# Altium schematic sheet HF_LPF.SchDoc: PA HF
size 420 x 297 mm; Date: 19.02.2023; ApprovedBy: UA3REO; CheckedBy: UA3REO; Author: RU4PN; CompanyName: WolfTeam; DrawnBy: UA3REO; Engineer: UA3REO; Address1: 1; Address2: 2; Address3: 3; Address4: 4; DocumentNumber: W2 - HF AMP  - LPF; Revision: 0.1; SheetNumber: 3; SheetTotal: 3
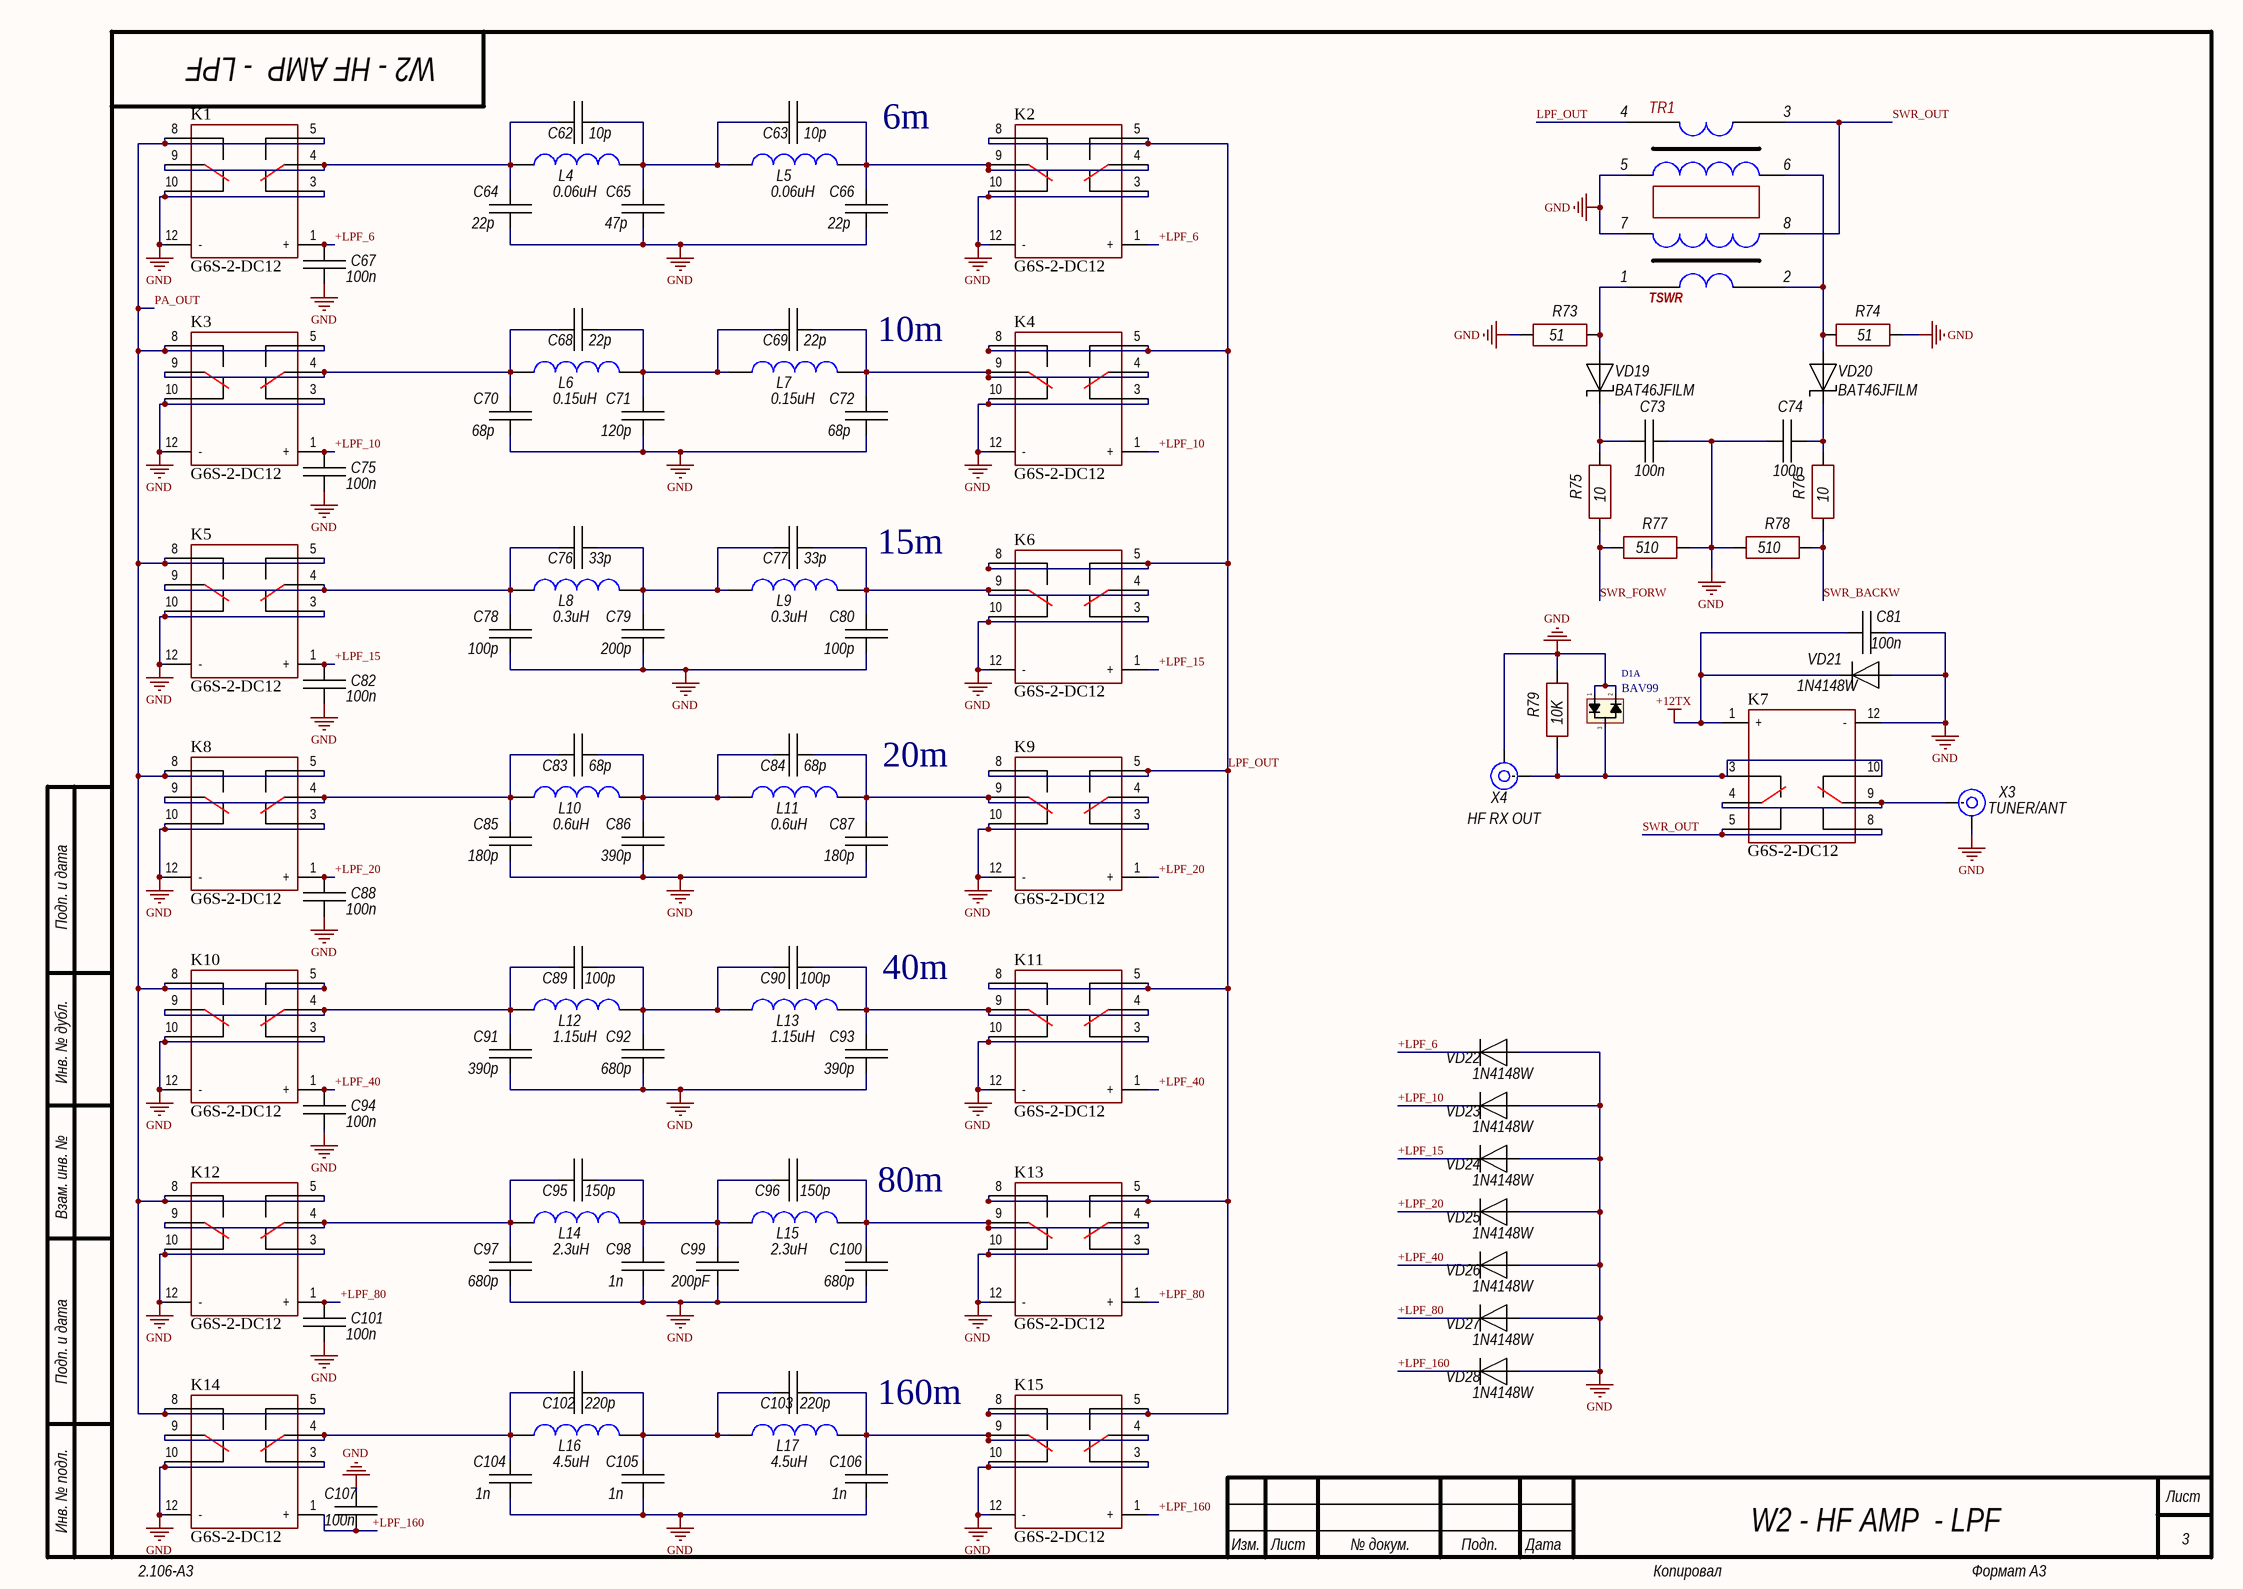
[diagram p0: HF_LPF.SchDoc]

## Parts
C62  10p  [CH1206ATC]
C63  10p  [CH1206ATC]
C64  22p  [CH1206ATC]
C65  47p  [CH1206ATC]
C66  22p  [CH1206ATC]
C67  100n  [CH0805C]
C68  22p  [CH1206ATC]
C69  22p  [CH1206ATC]
C70  68p  [CH1206ATC]
C71  120p  [CH1206ATC]
C72  68p  [CH1206ATC]
C73  100n  [CH1206C]
C74  100n  [CH1206C]
C75  100n  [CH0805C]
C76  33p  [CH1206ATC]
C77  33p  [CH1206ATC]
C78  100p  [CH1206ATC]
C79  200p  [CH1206ATC]
C80  100p  [CH1206ATC]
C81  100n  [CH1206C]
C82  100n  [CH0805C]
C83  68p  [CH1206ATC]
C84  68p  [CH1206ATC]
C85  180p  [CH1206ATC]
C86  390p  [CH1206ATC]
C87  180p  [CH1206ATC]
C88  100n  [CH0805C]
C89  100p  [CH1206ATC]
C90  100p  [CH1206ATC]
C91  390p  [CH1206ATC]
C92  680p  [CH1206ATC]
C93  390p  [CH1206ATC]
C94  100n  [CH0805C]
C95  150p  [CH1206ATC]
C96  150p  [CH1206ATC]
C97  680p  [CH1206ATC]
C98  1n  [CH1206ATC]
C99  200pF  [CH1206ATC]
C100  680p  [CH1206ATC]
C101  100n  [CH0805C]
C102  220p  [CH1206ATC]
C103  220p  [CH1206ATC]
C104  1n  [CH1206ATC]
C105  1n  [CH1206ATC]
C106  1n  [CH1206ATC]
C107  100n  [CH0805C]
D1  BAV99  [SOT23_132]  (part A of 2)
K1  G6S-2-DC12  [G6S-2-DC12]
K2  G6S-2-DC12  [G6S-2-DC12]
K3  G6S-2-DC12  [G6S-2-DC12]
K4  G6S-2-DC12  [G6S-2-DC12]
K5  G6S-2-DC12  [G6S-2-DC12]
K6  G6S-2-DC12  [G6S-2-DC12]
K7  G6S-2-DC12  [G6S-2-DC12]
K8  G6S-2-DC12  [G6S-2-DC12]
K9  G6S-2-DC12  [G6S-2-DC12]
K10  G6S-2-DC12  [G6S-2-DC12]
K11  G6S-2-DC12  [G6S-2-DC12]
K12  G6S-2-DC12  [G6S-2-DC12]
K13  G6S-2-DC12  [G6S-2-DC12]
K14  G6S-2-DC12  [G6S-2-DC12]
K15  G6S-2-DC12  [G6S-2-DC12]
L4  0.06uH  [DR1]
L5  0.06uH  [DR1]
L6  0.15uH  [DR1]
L7  0.15uH  [DR1]
L8  0.3uH  [T68-0]
L9  0.3uH  [T68-0]
L10  0.6uH  [T68-0]
L11  0.6uH  [T68-0]
L12  1.15uH  [T68-0]
L13  1.15uH  [T68-0]
L14  2.3uH  [T68-0]
L15  2.3uH  [T68-0]
L16  4.5uH  [T68-0]
L17  4.5uH  [T68-0]
R73  51  [CH1206R]
R74  51  [CH1206R]
R75  10  [CH0805R]
R76  10  [CH0805R]
R77  510  [CH0805R]
R78  510  [CH0805R]
R79  10K  [CH2512R]
TR1  TSWR  [TANDEM]
VD19  BAT46JFILM  [SOD323]
VD20  BAT46JFILM  [SOD323]
VD21  1N4148W  [SOD123]
VD22  1N4148W  [SOD123]
VD23  1N4148W  [SOD123]
VD24  1N4148W  [SOD123]
VD25  1N4148W  [SOD123]
VD26  1N4148W  [SOD123]
VD27  1N4148W  [SOD123]
VD28  1N4148W  [SOD123]
X3  TUNER/ANT  [CON: SMA]
X4  HF RX OUT  [CON: SMA]

## Nets
+12TX: C81.1 K7.1(+) VD21.2
GND: C64.1 C65.1 C66.1 C67.2 C70.1 C71.1 C72.1 C73.2 C74.1 C75.2 C78.1 C79.1 C80.1 C81.2 C82.2 C85.1 C86.1 C87.1 C88.2 C91.1 C92.1 C93.1 C94.2 C97.1 C98.1 C99.1 C100.1 C101.2 C104.1 C105.1 C106.1 C107.1 D1.1 D1.2 K1.3(NC_1) K1.10(NC_2) K1.12(-) K2.3(NC_1) K2.10(NC_2) K2.12(-) K3.3(NC_1) K3.10(NC_2) K3.12(-) K4.3(NC_1) K4.10(NC_2) K4.12(-) K5.3(NC_1) K5.10(NC_2) K5.12(-) K6.3(NC_1) K6.10(NC_2) K6.12(-) K7.12(-) K8.3(NC_1) K8.10(NC_2) K8.12(-) K9.3(NC_1) K9.10(NC_2) K9.12(-) K10.3(NC_1) K10.10(NC_2) K10.12(-) K11.3(NC_1) K11.10(NC_2) K11.12(-) K12.3(NC_1) K12.10(NC_2) K12.12(-) K13.3(NC_1) K13.10(NC_2) K13.12(-) K14.3(NC_1) K14.10(NC_2) K14.12(-) K15.3(NC_1) K15.10(NC_2) K15.12(-) R73.1 R74.2 R77.2 R78.1 R79.2 TR1.5 TR1.7 VD21.1 VD22.1 VD23.1 VD24.1 VD25.1 VD26.1 VD27.1 VD28.1 X3.2(IN) X4.2(IN)
+LPF_6: C67.1 K1.1(+) K2.1(+) VD22.2
+LPF_10: C75.1 K3.1(+) K4.1(+) VD23.2
+LPF_15: C82.1 K5.1(+) K6.1(+) VD24.2
+LPF_20: C88.1 K8.1(+) K9.1(+) VD25.2
+LPF_40: C94.1 K10.1(+) K11.1(+) VD26.2
+LPF_80: C101.1 K12.1(+) K13.1(+) VD27.2
+LPF_160: C107.2 K14.1(+) K15.1(+) VD28.2
LPF_OUT: K2.5(NO_1) K2.8(NO_2) K4.5(NO_1) K4.8(NO_2) K6.5(NO_1) K6.8(NO_2) K9.5(NO_1) K9.8(NO_2) K11.5(NO_1) K11.8(NO_2) K13.5(NO_1) K13.8(NO_2) K15.5(NO_1) K15.8(NO_2) TR1.4
PA_OUT: K1.5(NO_1) K1.8(NO_2) K3.5(NO_1) K3.8(NO_2) K5.5(NO_1) K5.8(NO_2) K8.5(NO_1) K8.8(NO_2) K10.5(NO_1) K10.8(NO_2) K12.5(NO_1) K12.8(NO_2) K14.5(NO_1) K14.8(NO_2)
SWR_BACKW: R76.1 R78.2
SWR_FORW: R75.1 R77.1
SWR_OUT: K7.5(NO_1) K7.8(NO_2) TR1.3 TR1.8
NetC62_1: C62.1 C63.2 C65.2 L4.1 L5.2
NetC62_2: C62.2 C64.2 K1.4(COM_1) K1.9(COM_2) L4.2
NetC63_1: C63.1 C66.2 K2.4(COM_1) K2.9(COM_2) L5.1
NetC68_1: C68.1 C69.2 C71.2 L6.1 L7.2
NetC68_2: C68.2 C70.2 K3.4(COM_1) K3.9(COM_2) L6.2
NetC69_1: C69.1 C72.2 K4.4(COM_1) K4.9(COM_2) L7.1
NetC73_1: C73.1 R75.2 VD19.2
NetC74_2: C74.2 R76.2 VD20.2
NetC76_1: C76.1 C77.2 C79.2 L8.1 L9.2
NetC76_2: C76.2 C78.2 K5.4(COM_1) K5.9(COM_2) L8.2
NetC77_1: C77.1 C80.2 K6.4(COM_1) K6.9(COM_2) L9.1
NetC83_1: C83.1 C84.2 C86.2 L10.1 L11.2
NetC83_2: C83.2 C85.2 K8.4(COM_1) K8.9(COM_2) L10.2
NetC84_1: C84.1 C87.2 K9.4(COM_1) K9.9(COM_2) L11.1
NetC89_1: C89.1 C90.2 C92.2 L12.1 L13.2
NetC89_2: C89.2 C91.2 K10.4(COM_1) K10.9(COM_2) L12.2
NetC90_1: C90.1 C93.2 K11.4(COM_1) K11.9(COM_2) L13.1
NetC95_1: C95.1 C96.2 C98.2 C99.2 L14.1 L15.2
NetC95_2: C95.2 C97.2 K12.4(COM_1) K12.9(COM_2) L14.2
NetC96_1: C96.1 C100.2 K13.4(COM_1) K13.9(COM_2) L15.1
NetC102_1: C102.1 C103.2 C105.2 L16.1 L17.2
NetC102_2: C102.2 C104.2 K14.4(COM_1) K14.9(COM_2) L16.2
NetC103_1: C103.1 C106.2 K15.4(COM_1) K15.9(COM_2) L17.1
NetD1_3: D1.3 K7.3(NC_1) K7.10(NC_2) R79.1 X4.1(IN)
NetK7_4: K7.4(COM_1) K7.9(COM_2) X3.1(IN)
NetR73_2: R73.2 TR1.1 VD19.1
NetR74_1: R74.1 TR1.2 TR1.6 VD20.1

## Notes on the sheet
- 6m
- 10m
- 15m
- 20m
- 40m
- 80m
- 160m
- Подп. и дата
- Инв. № дубл.
- Взам. инв. №
- Инв. № подл.
- Изм.
- Лист
- № докум.
- Подп.
- Дата
- 2.106-A3
- Копировал
- Формат А3

## Library data of the parts
C62-C107 = Capacitor: Manufacturer: *; Model: *; HelpURL: *; ComponentKind: *; Value: *
K1-K15 = G6S-2-DC12V_2
L4-L17 = Inductor ring: Value: {Value}; Model: *; ComponentKind: *; Manufacturer: *; HelpURL: *
R73-R79 = Resistor: Manufacturer: *; Model: *; HelpURL: *; ComponentKind: *; Value: *
TR1 = BN43-302
VD19 VD20 = Diod Schottky: ComponentKind: *; Manufacturer: *; Model: *; HelpURL: *
VD21-VD28 = Diod: ComponentKind: *; Manufacturer: *; Model: *; HelpURL: *
X3 X4 = SMA: RF; Model: *; Manufacturer: *; HelpURL: *; ComponentKind: *